# Altium schematic sheet CAN_SNIFFER.SchDoc
size A3
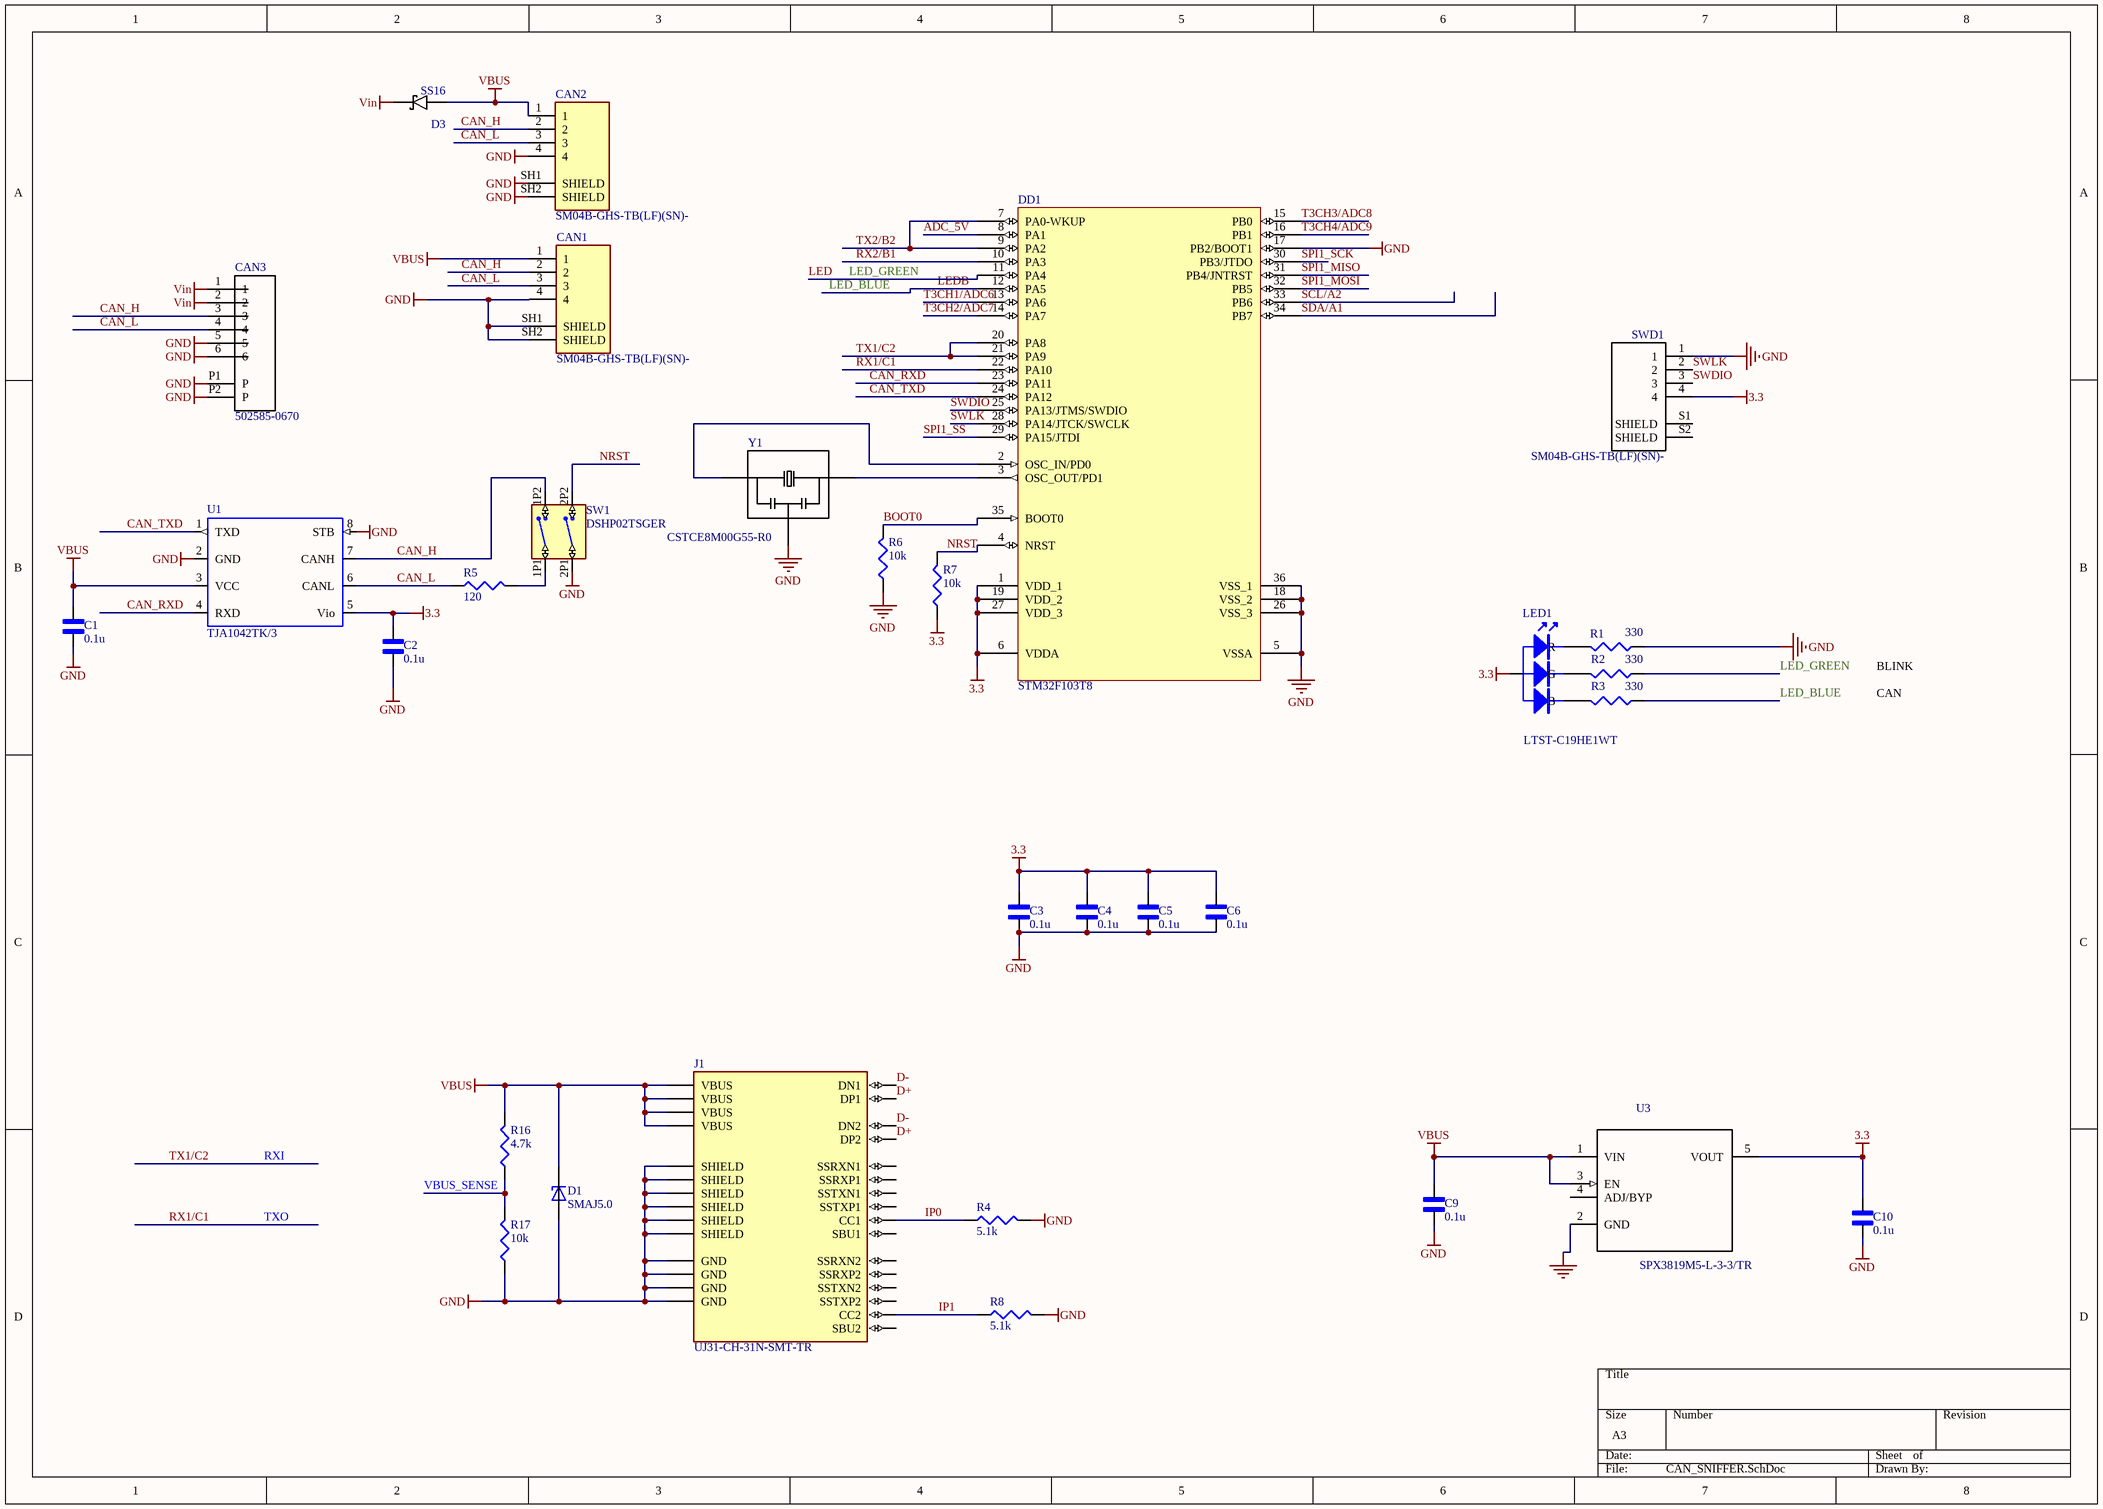
[diagram p0: CAN_SNIFFER.SchDoc]

## Parts
C1  value 0.1u  [CAPC1005X55N]  (hidden comment: GCM155R71H104KE02D)
C2  value 0.1u  [CAPC1005X55N]  (hidden comment: GCM155R71H104KE02D)
C3  value 0.1u  [CAPC1005X55N]  (hidden comment: GCM155R71H104KE02D)
C4  value 0.1u  [CAPC1005X55N]  (hidden comment: GCM155R71H104KE02D)
C5  value 0.1u  [CAPC1005X55N]  (hidden comment: GCM155R71H104KE02D)
C6  value 0.1u  [CAPC1005X55N]  (hidden comment: GCM155R71H104KE02D)
C9  value 0.1u  [CAPC1005X55N]  (hidden comment: GCM155R71H104KE02D)
C10  value 0.1u  [CAPC1005X55N]  (hidden comment: GCM155R71H104KE02D)
CAN1  SM04B-GHS-TB(LF)(SN)-  [JST_SM04B-GHS-TB(LF)(SN)-]
CAN2  SM04B-GHS-TB(LF)(SN)-  [JST_SM04B-GHS-TB(LF)(SN)-]
CAN3  502585-0670  [MOLEX_502585-0670]
D1  SMAJ5.0  [DIOM4325X250N]
D3  SS16  [*DIOM5227X250N_SS16(Primary)]
DD1  STM32F103T8  [*QFN50P600X600X100-37N]
J1  UJ31-CH-31N-SMT-TR  [CUI_UJ31-CH-31N-SMT-TR]
LED1  LTST-C19HE1WT  [LTST-C19HE1WT]
R1  value 330  [RESC1005X40N]  (hidden comment: RC0402FR-07330RL)
R2  value 330  [RESC1005X40N]  (hidden comment: RC0402FR-07330RL)
R3  value 330  [RESC1005X40N]  (hidden comment: RC0402FR-07330RL)
R4  value 5.1k  [RESC1005X40N]  (hidden comment: RC0402FR-075K1L)
R5  value 120  [RESC1005X40N]  (hidden comment: RC0402FR-07120RL)
R6  value 10k  [RESC1005X40N]  (hidden comment: RC0402FR-0710KL)
R7  value 10k  [RESC1005X40N]  (hidden comment: RC0402FR-0710KL)
R8  value 5.1k  [RESC1005X40N]  (hidden comment: RC0402FR-075K1L)
R16  value 4.7k  [RESC1005X40N]  (hidden comment: RC0402FR-074K7L)
R17  value 10k  [RESC1005X40N]  (hidden comment: RC0402FR-0710KL)
SW1  DSHP02TSGER  [DSHP02TSGER]
SWD1  SM04B-GHS-TB(LF)(SN)-  [JST_BM04B-GHS-holes]
U1  TJA1042TK/3  [SOT782-1]
U3  SPX3819M5-L-3-3/TR  [*SOT95P280X145-5N]
Y1  CSTCE8M00G55-R0  [*OSC_CSTCE8M00G55-R0]

## Nets
3.3: C2.2 C3.2 C4.2 C5.2 C6.2 C10.2 DD1.1(VDD_1) DD1.6(VDDA) DD1.19(VDD_2) DD1.27(VDD_3) LED1.4(A) R7.1 SWD1.4 U1.5(Vio) U3.5(VOUT)
GND: C1.1 C2.1 C3.1 C4.1 C5.1 C6.1 C9.1 C10.1 CAN1.4 CAN1.SH1(SHIELD) CAN1.SH2(SHIELD) CAN2.4 CAN2.SH1(SHIELD) CAN2.SH2(SHIELD) CAN3.5 CAN3.6 CAN3.P1(P) CAN3.P2(P) D1.A DD1.5(VSSA) DD1.17(PB2/BOOT1) DD1.18(VSS_2) DD1.26(VSS_3) DD1.36(VSS_1) J1.A1(GND) J1.A12(GND) J1.B1(GND) J1.B12(GND) J1.SH1(SHIELD) J1.SH2(SHIELD) J1.SH3(SHIELD) J1.SH4(SHIELD) J1.SH5(SHIELD) J1.SH6(SHIELD) R1.1 R4.2 R6.1 R8.2 R17.1 SW1.2P1 SWD1.1 U1.2(GND) U1.8(STB) U3.2(GND) Y1.2
VBUS: C1.2 C9.2 CAN1.1 CAN2.1 D1.C D3.A J1.A4(VBUS) J1.A9(VBUS) J1.B4(VBUS) J1.B9(VBUS) R16.2 U1.3(VCC) U3.1(VIN) U3.3(EN)
Vin: CAN3.1 CAN3.2 D3.C(K)
ADC_5V: DD1.8(PA1)
BOOT0: DD1.35(BOOT0) R6.2
CAN_H: CAN1.2 CAN2.2 CAN3.3 SW1.1P2 U1.7(CANH)
CAN_L: CAN1.3 CAN2.3 CAN3.4 R5.1 U1.6(CANL)
CAN_RXD: DD1.23(PA11) U1.4(RXD)
CAN_TXD: DD1.24(PA12) U1.1(TXD)
D+: J1.A6(DP1) J1.B6(DP2)
D-: J1.A7(DN1) J1.B7(DN2)
IP0: J1.A5(CC1) R4.1
IP1: J1.B5(CC2) R8.1
LED: DD1.11(PA4) R2.1  [also labelled LED_GREEN]
LED_BLUE: DD1.12(PA5) R3.1  [also labelled LEDB]
NRST: DD1.4(NRST) R7.2 SW1.2P2
RX1/C1: DD1.22(PA10)  [also labelled TXO]
RX2/B1: DD1.10(PA3)
RXI: DD1.20(PA8) DD1.21(PA9)  [also labelled TX1/C2]
SCL/A2: DD1.33(PB6)
SDA/A1: DD1.34(PB7)
SPI1_MISO: DD1.31(PB4/JNTRST)
SPI1_MOSI: DD1.32(PB5)
SPI1_SCK: DD1.30(PB3/JTDO)
SPI1_SS: DD1.29(PA15/JTDI)
SWDIO: DD1.25(PA13/JTMS/SWDIO) SWD1.3
SWLK: DD1.28(PA14/JTCK/SWCLK) SWD1.2
T3CH1/ADC6: DD1.13(PA6)
T3CH2/ADC7: DD1.14(PA7)
T3CH3/ADC8: DD1.15(PB0)
T3CH4/ADC9: DD1.16(PB1)
TX2/B2: DD1.7(PA0-WKUP) DD1.9(PA2)
VBUS_SENSE: R16.1 R17.2
NetDD1_2: DD1.2(OSC_IN/PD0) Y1.1
NetDD1_3: DD1.3(OSC_OUT/PD1) Y1.3
NetLED1_1: LED1.1(R) R1.2
NetLED1_2: LED1.2(G) R2.2
NetLED1_3: LED1.3(B) R3.2
NetR5_2: R5.2 SW1.1P1

Not connected (* = marked no-connect by the designer): J1 A2(SSTXP1) A3(SSTXN1) A8(SBU1) A10(SSRXN2) A11(SSRXP2) B2(SSTXP2) B3(SSTXN2) B8(SBU2) B10(SSRXN1) B11(SSRXP1); SWD1 S1(SHIELD) S2(SHIELD); U3 4(ADJ/BYP)

## Notes on the sheet
- CAN
- BLINK

## Library data of the parts
C1-C6 C9 C10 = GCM155R71H104KE02D: GCM155R71H104KE02D, Чип 0402 X7R 0.1uF +10% 50V,Конденсатор; MF: Murata; Type: SMD; SnapEDA_Link: https://www.snapeda.com/parts/GCM155R71H104KE02D/Murata%20Electronics%20North%20America/view-part/597463/?ref=snap; Package: 0402; MP: GCM155R71H104KE02D; ChipDip_Link: https://www.chipdip.ru/product/gcm155r71h104ke02d-murata
CAN1 CAN2 = SM04B-GHS-TB(LF)(SN)-: Connector Header Surface Mount, Right Angle 4 position 0.049 _1.25mm_; MF: JST Sales; MP: SM04B-GHS-TB(LF)(SN); Package: None; Value: *; SnapEDA_Link: https://www.snapeda.com/parts/SM04B-GHS-TB%28LF%29%28SN%29-/JST%20Sales%20America%20Inc./view-part/2759740/?ref=snap; HelpURL: http://www.farnell.com/datasheets/2082975.pdf; System: Connector; ChipDip_Link: https://www.chipdip.ru/product/sm04b-ghs-tb-lf-sn-gh-1.25mm-header-side-ent; Type: SMD
CAN3 = 502585-0670: 1.50mm Pitch, CLIK-Mate PCB Receptacle, Single Row, Surface Mount, Right-Angle, Tin Plating, Positive Lock, 6 Circuits, Natural; MF: Molex; System: Connector; MP: 502585-0670; Package: None; SnapEDA_Link: https://www.snapeda.com/parts/502494-0670/Molex/view-part/?ref=snap; Value: *; Type: SMD
D1 = SMAJ5.0: 400W, 6.9V, 10%, Unidirectional, TVS; MF: Taiwan Semiconductor; Type: SMD; MP: SMAJ5.0; SnapEDA_Link: https://www.snapeda.com/parts/SMAJ5.0/Taiwan+Semiconductor/view-part/?ref=snap; Value: *; Package: DO-214AC-2 Taiwan Semiconductor
D3 = SS16: Diode Schottky 60V 1A Surface Mount SMA; Instructions: DNP; Type: SMD; SnapEDA_Link: https://www.snapeda.com/parts/SS16/ON%20Semiconductor/view-part/?ref=search&t=ss16; Value: *; ChipDip_Link: https://www.chipdip.ru/product/ss16; MP: SS16; Package: SMA-2
DD1 = STM32F103T8: STM32F103T8U6, Микроконтроллер 32BIT ARM 64K FLASH [VFQFPN-36]; MF: STM; ChipDip_Link: https://www.chipdip.ru/product/stm32f103t8u6-2; HelpURL: http://www.st.com/stonline/products/literature/ds/13587.pdf; MP: STM32F103T8U6; Package: VFQFPN-36; SnapEDA_Link: https://www.snapeda.com/parts/STM32F103T8U6TR/STMicroelectronics/view-part/?ref=search&t=STM32F103T8U6; Type: SMD
J1 = UJ31-CH-31N-SMT-TR: Type C, USB 3.1 Gen 2, 5 A, Right Angle, Surface Mount _SMT_, USB Receptacle; MF: CUI Devices; System: Connector; Value: *; SnapEDA_Link: https://www.snapeda.com/parts/UJ31-CH-31N-SMT-TR/CUI%20Devices/view-part/2776725/?ref=snap; Package: None; MP: UJ31-CH-31N-SMT-TR; ChipDip_Link: https://www.chipdip.ru/product1/8002862225; HelpURL: https://www.chipdip.ru/product1/8002862225; Type: SMT
LED1 = RGB_LED_5MM: Blue/Green/Red; Type: SMD; ChipDip_Link: https://www.chipdip.ru/product1/8003387462; HelpURL: https://static.chipdip.ru/lib/039/DOC013039662.pdf; MP: LTST-C19HE1WT
R1-R3 = RC0402FR-07330RL: 0.062Вт 0402 330 Ом, 1%, Чип резистор (SMD); Pacage Metric: 1005; MF: Yageo or NXP; ChipDip_Link: https://www.chipdip.ru/product0/9000189640; HelpURL: https://www.chipdip.ru/product0/9000189640; Package: RC0402; Type: SMD; MP: RC0402FR-07330RL; SnapEDA_Link: https://www.snapeda.com/parts/CRGCQ0402F10K/TE%20Connectivity/view-part/3186991/?ref=search&t=0402%2010k
R4 R8 = RC0402FR-054K1L: 0.062Вт 0402 5.1 кОм, 1%, Чип резистор (SMD); MF: Yageo or NXP; ChipDip_Link: https://www.chipdip.ru/product0/9000189640; HelpURL: https://www.chipdip.ru/product0/9000189640; Package: RC0402; Type: SMD; MP: RC0402FR-075K1L; SnapEDA_Link: https://www.snapeda.com/parts/CRGCQ0402F10K/TE%20Connectivity/view-part/3186991/?ref=search&t=0402%2010k
R5 = RC0402FR-07120RL: 0.062Вт 0402 120 Ом, 1%, Чип резистор (SMD); MF: Yageo or NXP; ChipDip_Link: https://www.chipdip.ru/product0/9000189640; HelpURL: https://www.chipdip.ru/product0/9000189640; Package: RC0402; Type: SMD; MP: RC0402FR-07120RL; SnapEDA_Link: https://www.snapeda.com/parts/CRGCQ0402F10K/TE%20Connectivity/view-part/3186991/?ref=search&t=0402%2010k
R6 R7 R17 = RC0402FR-0710KL: 0.062Вт 0402 10 кОм, 1%, Чип резистор (SMD); MF: Yageo or NXP; ChipDip_Link: https://www.chipdip.ru/product0/9000189640; HelpURL: https://www.chipdip.ru/product0/9000189640; Package: RC0402; Type: SMD; MP: RC0402FR-0710KL; SnapEDA_Link: https://www.snapeda.com/parts/CRGCQ0402F10K/TE%20Connectivity/view-part/3186991/?ref=search&t=0402%2010k
R16 = RC0402FR-074K7L: 0.062Вт 0402 4.7 кОм, 1%, Чип резистор (SMD); MF: Yageo or NXP; ChipDip_Link: https://www.chipdip.ru/product0/9000189640; HelpURL: https://www.chipdip.ru/product0/9000189640; Package: RC0402; Type: SMD; MP: RC0402FR-074K7L; SnapEDA_Link: https://www.snapeda.com/parts/CRGCQ0402F10K/TE%20Connectivity/view-part/3186991/?ref=search&t=0402%2010k
SW1 = DSHP02TSGER: DSHP Series 1.27mm Pitch DIP Switch 4 POS; MF: KINGTEK INDUSTRIAL; Check_prices: https://www.snapeda.com/parts/DSHP02TSGER/GTE/view-part/4478207/?ref=eda; Package: None; Value: *; MP: DSHP02TSGER; Price: None; Availability: Warning; SnapEDA_Link: https://www.snapeda.com/parts/DSHP02TSGER/GTE/view-part/4478207/?ref=snap; HelpURL: https://item.szlcsc.com/3856577.html
SWD1 = SWD SM04B-GHS-TB(LF)(SN)-: Conn Shrouded Header HDR 4 POS 1.25mm Solder ST SMD Reel; MF: JST Sales; Instructions: DNP; System: Connector; SnapEDA_Link: https://www.snapeda.com/parts/BM04B-GHS-TBT%28LF%29%28SN%29%28N%29/JST%20Sales%20America%20Inc./view-part/?ref=snap; MP: SM04B-GHS-TB(LF)(SN); Package: None; Value: *; Type: SMD
U1 = TJA1042: 1/1 Transceiver Half CANbus 8-SO; MF: NXP USA; SnapEDA_Link: https://www.snapeda.com/parts/TJA1042/NXP%20USA%20Inc./view-part/900919/?ref=snap; Value: *; MP: TJA1042TK/3; Package: VDFN-8 NXP USA; ChipDip_Link: https://www.chipdip.ru/product1/8002840332; HelpURL: https://static.chipdip.ru/lib/583/DOC001583059.pdf; Type: SMD
U3 = SPX3819M5-L-3-3/TR: Low Dropout Voltage Regulator, Adjustable 0.5A, В±1%, 2.5 to 16 Vin, 5-Pin SOT-23; MF: MaxLinear, Inc.; Value: 3V3; MP: SPX3819M5-L-3-3/TR; Package: SOT-23-5 Exar; SnapEDA_Link: https://www.snapeda.com/parts/SPX3819M5-L/MaxLinear%2C%20Inc./view-part/?ref=snap; Type: SMD; ChipDip_Link: https://www.chipdip.ru/product1/8003455237; HelpURL: http://www.farnell.com/datasheets/2614478.pdf
Y1 = CSTCE8M00G55-R0: Ceramic Resonator 8MHz ??0.5% _Tol_ ??0.2% _Stability_ 33pF 40Ohm 3-Pin CSMD T/R; MF: Murata; MP: CSTCE8M00G55-R0; Package: SMD-3 Murata; SnapEDA_Link: https://www.snapeda.com/parts/CSTCE8M00G55-R0/Murata%20Electronics%20North%20America/view-part/?ref=snap; Value: *; ChipDip_Link: https://www.chipdip.ru/product1/8001783721; HelpURL: https://www.murata.com/en-eu/api/pdfdownloadapi?cate=&partno=CSTCE8M00G55-R0; Type: SMD